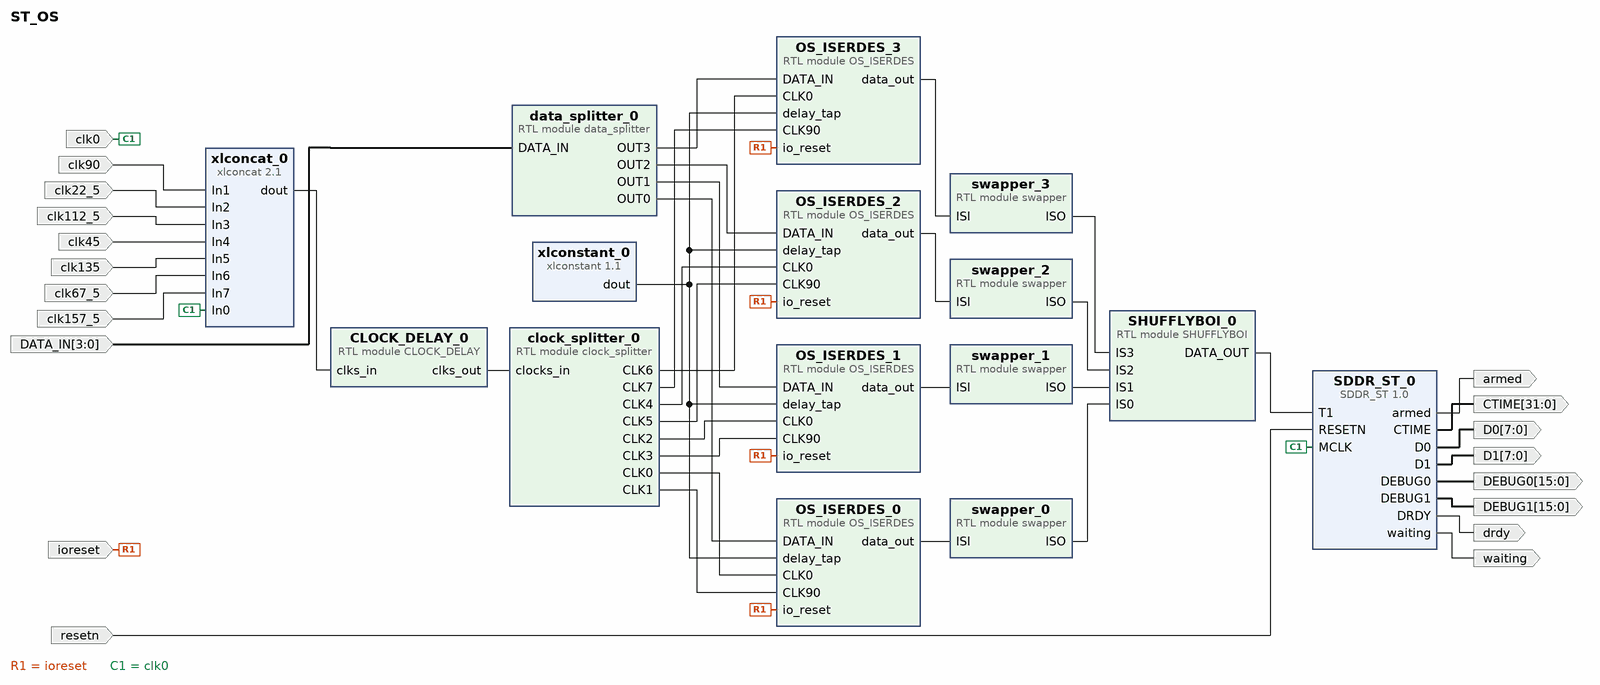
[diagram p0: block diagram of the top level]
# Vivado block design ST_OS, xc7z020clg400-1, Vivado 2019.1
create_bd_design ST_OS

create_bd_port -dir I -type rst ioreset
set_property -dict {CONFIG.POLARITY ACTIVE_HIGH} [get_bd_ports ioreset]
create_bd_port -dir I -type rst resetn
set_property -dict {CONFIG.POLARITY ACTIVE_LOW} [get_bd_ports resetn]
create_bd_port -dir I -type clk clk0
set_property -dict {CONFIG.FREQ_HZ 400000000} [get_bd_ports clk0]
create_bd_port -dir I -type clk clk90
set_property -dict {CONFIG.FREQ_HZ 400000000} [get_bd_ports clk90]
create_bd_port -dir O -from 7 -to 0 D0
create_bd_port -dir O -from 7 -to 0 D1
create_bd_port -dir O drdy
create_bd_port -dir O waiting
create_bd_port -dir O armed
create_bd_port -dir O -from 31 -to 0 CTIME
create_bd_port -dir O -from 15 -to 0 DEBUG0
create_bd_port -dir O -from 15 -to 0 DEBUG1
create_bd_port -dir I -type clk clk45
set_property -dict {CONFIG.FREQ_HZ 400000000} [get_bd_ports clk45]
create_bd_port -dir I -type clk clk135
set_property -dict {CONFIG.FREQ_HZ 400000000} [get_bd_ports clk135]
create_bd_port -dir I -type clk clk22_5
set_property -dict {CONFIG.FREQ_HZ 400000000} [get_bd_ports clk22_5]
create_bd_port -dir I -type clk clk112_5
set_property -dict {CONFIG.FREQ_HZ 400000000} [get_bd_ports clk112_5]
create_bd_port -dir I -type clk clk157_5
set_property -dict {CONFIG.FREQ_HZ 400000000} [get_bd_ports clk157_5]
create_bd_port -dir I -type clk clk67_5
set_property -dict {CONFIG.FREQ_HZ 400000000} [get_bd_ports clk67_5]
create_bd_port -dir I -from 3 -to 0 DATA_IN

create_bd_cell -type ip -vlnv cri.nz:user:SDDR_ST:1.0 SDDR_ST_0
set_property -dict {CONFIG.SIG_WIDTH 16} [get_bd_cells SDDR_ST_0]
create_bd_cell -type module -reference SHUFFLYBOI SHUFFLYBOI_0
set_property -dict {CONFIG.factor 4 CONFIG.input_width 4} [get_bd_cells SHUFFLYBOI_0]
create_bd_cell -type module -reference swapper swapper_0
create_bd_cell -type module -reference swapper swapper_1
create_bd_cell -type module -reference data_splitter data_splitter_0
create_bd_cell -type ip -vlnv xilinx.com:ip:xlconstant:1.1 xlconstant_0
set_property -dict {CONFIG.CONST_VAL 0 CONFIG.CONST_WIDTH 4} [get_bd_cells xlconstant_0]
create_bd_cell -type module -reference swapper swapper_2
create_bd_cell -type module -reference swapper swapper_3
create_bd_cell -type module -reference OS_ISERDES OS_ISERDES_0
set_property -dict {CONFIG.idelay_group TEMP} [get_bd_cells OS_ISERDES_0]
create_bd_cell -type module -reference OS_ISERDES OS_ISERDES_1
set_property -dict {CONFIG.idelay_group TEMP} [get_bd_cells OS_ISERDES_1]
create_bd_cell -type module -reference OS_ISERDES OS_ISERDES_2
set_property -dict {CONFIG.idelay_group TEMP} [get_bd_cells OS_ISERDES_2]
create_bd_cell -type module -reference OS_ISERDES OS_ISERDES_3
set_property -dict {CONFIG.idelay_group TEMP} [get_bd_cells OS_ISERDES_3]
create_bd_cell -type module -reference clock_splitter clock_splitter_0
create_bd_cell -type module -reference CLOCK_DELAY CLOCK_DELAY_0
set_property -dict {CONFIG.delay_group TEST} [get_bd_cells CLOCK_DELAY_0]
create_bd_cell -type ip -vlnv xilinx.com:ip:xlconcat:2.1 xlconcat_0
set_property -dict {CONFIG.NUM_PORTS 8} [get_bd_cells xlconcat_0]

# ---- connections ----

connect_bd_net [get_bd_ports resetn] [get_bd_pins SDDR_ST_0/RESETN]
connect_bd_net [get_bd_ports ioreset] \
  [get_bd_pins OS_ISERDES_0/io_reset] [get_bd_pins OS_ISERDES_1/io_reset] [get_bd_pins OS_ISERDES_2/io_reset] \
  [get_bd_pins OS_ISERDES_3/io_reset]
connect_bd_net -net clk0_1 [get_bd_ports clk0] [get_bd_pins SDDR_ST_0/MCLK] [get_bd_pins xlconcat_0/In0]
connect_bd_net [get_bd_pins SDDR_ST_0/D0] [get_bd_ports D0]
connect_bd_net [get_bd_pins SDDR_ST_0/D1] [get_bd_ports D1]
connect_bd_net [get_bd_pins SDDR_ST_0/DRDY] [get_bd_ports drdy]
connect_bd_net [get_bd_pins SDDR_ST_0/waiting] [get_bd_ports waiting]
connect_bd_net [get_bd_pins SDDR_ST_0/armed] [get_bd_ports armed]
connect_bd_net [get_bd_pins SDDR_ST_0/CTIME] [get_bd_ports CTIME]
connect_bd_net [get_bd_pins SDDR_ST_0/DEBUG0] [get_bd_ports DEBUG0]
connect_bd_net [get_bd_pins SDDR_ST_0/DEBUG1] [get_bd_ports DEBUG1]
connect_bd_net [get_bd_pins SHUFFLYBOI_0/DATA_OUT] [get_bd_pins SDDR_ST_0/T1]
connect_bd_net [get_bd_pins OS_ISERDES_0/data_out] [get_bd_pins swapper_0/ISI]
connect_bd_net [get_bd_pins swapper_0/ISO] [get_bd_pins SHUFFLYBOI_0/IS0]
connect_bd_net [get_bd_pins OS_ISERDES_1/data_out] [get_bd_pins swapper_1/ISI]
connect_bd_net [get_bd_pins swapper_1/ISO] [get_bd_pins SHUFFLYBOI_0/IS1]
connect_bd_net [get_bd_ports DATA_IN] [get_bd_pins data_splitter_0/DATA_IN]
connect_bd_net [get_bd_pins data_splitter_0/OUT0] [get_bd_pins OS_ISERDES_0/DATA_IN]
connect_bd_net [get_bd_pins data_splitter_0/OUT1] [get_bd_pins OS_ISERDES_1/DATA_IN]
connect_bd_net [get_bd_pins data_splitter_0/OUT2] [get_bd_pins OS_ISERDES_2/DATA_IN]
connect_bd_net [get_bd_pins data_splitter_0/OUT3] [get_bd_pins OS_ISERDES_3/DATA_IN]
connect_bd_net [get_bd_pins xlconstant_0/dout] \
  [get_bd_pins OS_ISERDES_0/delay_tap] [get_bd_pins OS_ISERDES_1/delay_tap] [get_bd_pins OS_ISERDES_2/delay_tap] \
  [get_bd_pins OS_ISERDES_3/delay_tap]
connect_bd_net [get_bd_pins OS_ISERDES_2/data_out] [get_bd_pins swapper_2/ISI]
connect_bd_net [get_bd_pins OS_ISERDES_3/data_out] [get_bd_pins swapper_3/ISI]
connect_bd_net [get_bd_pins swapper_3/ISO] [get_bd_pins SHUFFLYBOI_0/IS3]
connect_bd_net [get_bd_pins swapper_2/ISO] [get_bd_pins SHUFFLYBOI_0/IS2]
connect_bd_net [get_bd_pins xlconcat_0/dout] [get_bd_pins CLOCK_DELAY_0/clks_in]
connect_bd_net [get_bd_pins CLOCK_DELAY_0/clks_out] [get_bd_pins clock_splitter_0/clocks_in]
connect_bd_net -net clk90_1 [get_bd_ports clk90] [get_bd_pins xlconcat_0/In1]
connect_bd_net -net clk22_5_1 [get_bd_ports clk22_5] [get_bd_pins xlconcat_0/In2]
connect_bd_net -net clk112_5_1 [get_bd_ports clk112_5] [get_bd_pins xlconcat_0/In3]
connect_bd_net -net clk45_1 [get_bd_ports clk45] [get_bd_pins xlconcat_0/In4]
connect_bd_net -net clk135_1 [get_bd_ports clk135] [get_bd_pins xlconcat_0/In5]
connect_bd_net -net clk67_5_1 [get_bd_ports clk67_5] [get_bd_pins xlconcat_0/In6]
connect_bd_net -net clk157_5_1 [get_bd_ports clk157_5] [get_bd_pins xlconcat_0/In7]
connect_bd_net [get_bd_pins clock_splitter_0/CLK0] [get_bd_pins OS_ISERDES_0/CLK0]
connect_bd_net [get_bd_pins clock_splitter_0/CLK1] [get_bd_pins OS_ISERDES_0/CLK90]
connect_bd_net [get_bd_pins clock_splitter_0/CLK2] [get_bd_pins OS_ISERDES_1/CLK0]
connect_bd_net [get_bd_pins clock_splitter_0/CLK3] [get_bd_pins OS_ISERDES_1/CLK90]
connect_bd_net [get_bd_pins clock_splitter_0/CLK4] [get_bd_pins OS_ISERDES_2/CLK0]
connect_bd_net [get_bd_pins clock_splitter_0/CLK5] [get_bd_pins OS_ISERDES_2/CLK90]
connect_bd_net [get_bd_pins clock_splitter_0/CLK6] [get_bd_pins OS_ISERDES_3/CLK0]
connect_bd_net [get_bd_pins clock_splitter_0/CLK7] [get_bd_pins OS_ISERDES_3/CLK90]

validate_bd_design
save_bd_design
